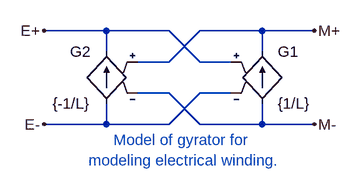
[diagram p0: schematic gyrator.asc]
gyrator.asc, the LTspice schematic file:
Version 4
SHEET 1 1268 680
WIRE -176 48 -272 48
WIRE -176 80 -176 48
WIRE -176 192 -272 192
WIRE -176 192 -176 160
WIRE -80 48 -176 48
WIRE -80 96 -128 96
WIRE -80 144 -128 144
WIRE -80 192 -176 192
WIRE -32 48 -80 96
WIRE -32 96 -80 48
WIRE -32 144 -80 192
WIRE -32 192 -80 144
WIRE 16 96 -32 96
WIRE 16 144 -32 144
WIRE 64 48 -32 48
WIRE 64 80 64 48
WIRE 64 192 -32 192
WIRE 64 192 64 160
WIRE 144 48 64 48
WIRE 144 192 64 192
FLAG -272 48 E+
FLAG -272 192 E-
FLAG 144 48 M+
FLAG 144 192 M-
SYMBOL g 64 64 R0
SYMATTR InstName G1
SYMATTR Value {1/L}
SYMBOL g -176 64 M0
SYMATTR InstName G2
SYMATTR Value {-1/L}
TEXT -56 232 Center 0 ;Model of gyrator for \nmodeling electrical winding.

The netlist it stands for:
* gyrator.asc
G1 M- M+ E+ E- {1/L}
G2 E- E+ M+ M- {-1/L}
* Model of gyrator for
* modeling electrical winding.
.backanno
.end